# Altium project PCB_Project.PrjPcb
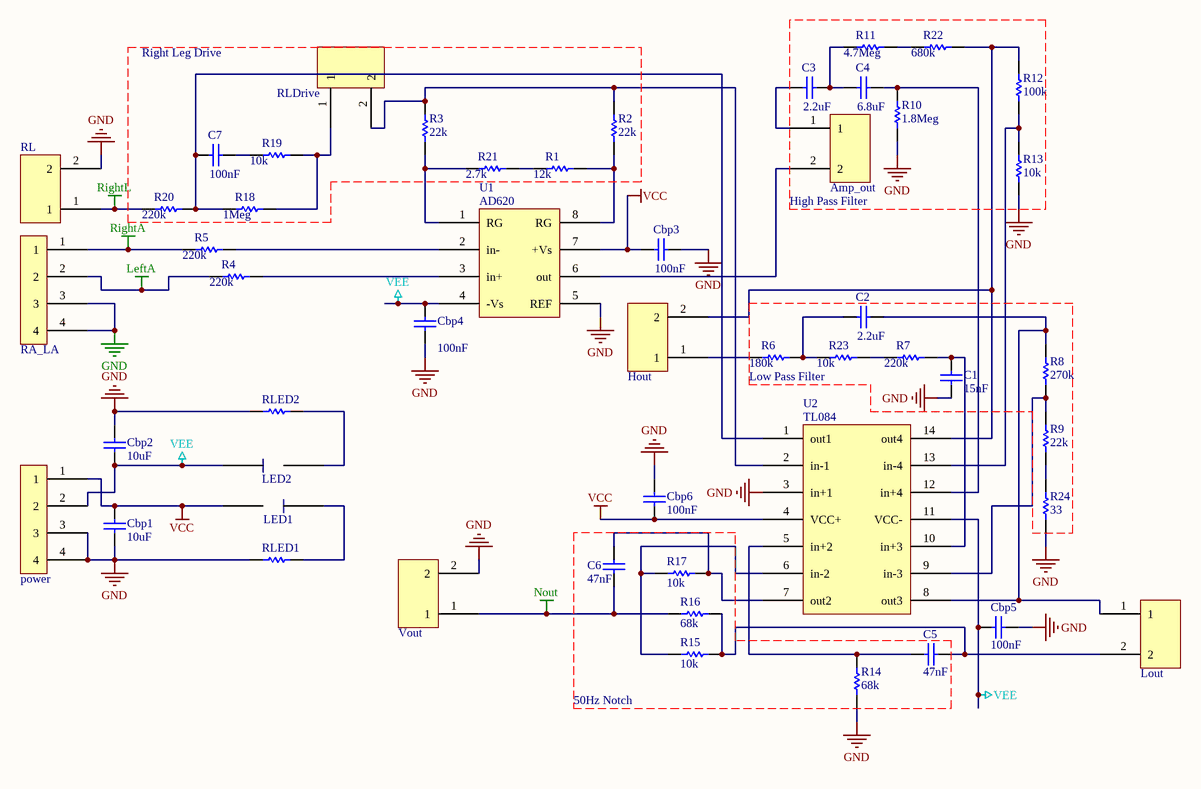
[diagram p0: Sheet2.~(3).SchDoc]
1 sheet, 51 parts. Net scope: global (net labels, ports and power ports of the same name join across sheets).
Board file: PCB5.PcbDoc

## Sheet Sheet2.~(3).SchDoc
size A4

### Parts
Amp_out  port  [pinheader]  (value not drawn)
C1  value 15nF  [cap]  (hidden comment: Cap)
C2  value 2.2uF  [cap]  (hidden comment: Cap)
C3  value 2.2uF  [cap]  (hidden comment: Cap)
C4  value 6.8uF  [cap]  (hidden comment: Cap)
C5  value 47nF  [cap]  (hidden comment: Cap)
C6  value 47nF  [cap]  (hidden comment: Cap)
C7  value 100nF  [cap]  (hidden comment: Cap)
Cbp1  value 10uF  [cap]  (hidden comment: Cap)
Cbp2  value 10uF  [cap]  (hidden comment: Cap)
Cbp3  value 100nF  [cap]  (hidden comment: Cap)
Cbp4  value 100nF  [cap]  (hidden comment: Cap)
Cbp5  value 100nF  [cap]  (hidden comment: Cap)
Cbp6  value 100nF  [cap]  (hidden comment: Cap)
Hout  port  [pinheader]  (value not drawn)
LED1  LED1  [LED1]  (value not drawn)
LED2  LED1  [LED1]  (value not drawn)
Lout  port  [pinheader]  (value not drawn)
power  pin4  [PINHEADER4]  (value not drawn)
R1  value 12k  [res]  (hidden comment: Res Semi)
R2  value 22k  [res]  (hidden comment: Res Semi)
R3  value 22k  [res]  (hidden comment: Res Semi)
R4  value 220k  [res]  (hidden comment: Res Semi)
R5  value 220k  [res]  (hidden comment: Res Semi)
R6  value 180k  [res]  (hidden comment: Res Semi)
R7  value 220k  [res]  (hidden comment: Res Semi)
R8  value 270k  [res]  (hidden comment: Res Semi)
R9  value 22k  [res]  (hidden comment: Res Semi)
R10  value 1.8Meg  [res]  (hidden comment: Res Semi)
R11  value 4.7Meg  [res]  (hidden comment: Res Semi)
R12  value 100k  [res]  (hidden comment: Res Semi)
R13  value 10k  [res]  (hidden comment: Res Semi)
R14  value 68k  [res]  (hidden comment: Res Semi)
R15  value 10k  [res]  (hidden comment: Res Semi)
R16  value 68k  [res]  (hidden comment: Res Semi)
R17  value 10k  [res]  (hidden comment: Res Semi)
R18  value 1Meg  [res]  (hidden comment: Res Semi)
R19  value 10k  [res]  (hidden comment: Res Semi)
R20  value 220k  [res]  (hidden comment: Res Semi)
R21  value 2.7k  [res]  (hidden comment: Res Semi)
R22  value 680k  [res]  (hidden comment: Res Semi)
R23  value 10k  [res]  (hidden comment: Res Semi)
R24  value 33  [res]  (hidden comment: Res Semi)
RA_LA  pin4  [PINHEADER4]  (value not drawn)
RL  port  [pinheader]  (value not drawn)
RLDrive  port  [pinheader]  (value not drawn)
RLED1  Res Semi  [res]  (value not drawn)
RLED2  Res Semi  [res]  (value not drawn)
U1  AD620  [AD620]
U2  TL084  [TL084]
Vout  port  [pinheader]  (value not drawn)

### Nets
GND: C1.1 Cbp1.1 Cbp2.2 Cbp3.2 Cbp4.1 Cbp5.1 Cbp6.1 power.3 power.4 R10.1 R13.1 R14.1 R24.1 RA_LA.3 RA_LA.4 RL.2 RLED1.1 RLED2.1 U1.5(REF) U2.3(in+1) Vout.2
LeftA: R4.1 RA_LA.2
Nout: C6.1 R16.1 Vout.1
RightA: R5.1 RA_LA.1
RightL: R20.1 RL.1
VCC: Cbp1.2 Cbp3.1 Cbp6.2 LED1.2(Anode) power.1 U1.7(+Vs) U2.4(VCC+)
VEE: Cbp2.1 Cbp4.2 Cbp5.2 LED2.1(kathod) power.2 U1.4(-Vs) U2.11(VCC-)
NetAmp_out_1: Amp_out.1 C3.1
NetAmp_out_2: Amp_out.2 U1.6(out)
NetC1_2: C1.2 R7.2 U2.10(in+3)
NetC2_1: C2.1 R6.2 R23.1
NetC2_2: C2.2 Lout.1 R8.2 U2.8(out3)
NetC3_2: C3.2 C4.1 R11.1
NetC4_2: C4.2 R10.2 U2.12(in+4)
NetC5_1: C5.1 Lout.2 R15.2 R16.2
NetC5_2: C5.2 R14.2 U2.5(in+2)
NetC6_2: C6.2 R17.2 U2.7(out2)
NetC7_1: C7.1 R18.1 R20.2 U2.1(out1)
NetC7_2: C7.2 R19.1
NetHout_1: Hout.1 R6.1
NetHout_2: Hout.2 R12.2 R22.2 U2.14(out4)
NetLED1_1: LED1.1(kathod) RLED1.2
NetLED2_2: LED2.2(Anode) RLED2.2
NetR1_1: R1.1 R21.2
NetR1_2: R1.2 R2.1 U1.8(RG)
NetR2_2: R2.2 R3.1 RLDrive.2 U2.2(in-1)
NetR3_2: R3.2 R21.1 U1.1(RG)
NetR4_2: R4.2 U1.3(in+)
NetR5_2: R5.2 U1.2(in-)
NetR7_1: R7.1 R23.2
NetR8_1: R8.1 R9.2 U2.9(in-3)
NetR9_1: R9.1 R24.2
NetR11_2: R11.2 R22.1
NetR12_1: R12.1 R13.2 U2.13(in-4)
NetR15_1: R15.1 R17.1 U2.6(in-2)
NetR18_2: R18.2 R19.2 RLDrive.1

### Notes on the sheet
- Right Leg Drive
- (near Amp_out) High Pass Filter
- Low Pass Filter
- 50Hz Notch

### Library data of the parts
C1-C7 Cbp1-Cbp6 = Cap: Capacitor; Published: 8-Jun-2000; LatestRevisionDate: 17-Jul-2002; LatestRevisionNote: Re-released for DXP Platform.; PackageReference: RAD-0.3; Publisher: Altium Limited; PackageDescription: Radial Cap, Thru-Hole; 2 Leads; 0.3 in Pin Spacing
R1-R24 RLED1 RLED2 = Res Semi: Semiconductor Resistor; Published: 8-Jun-2000; LatestRevisionDate: 17-Jul-2002; LatestRevisionNote: Re-released for DXP Platform.; PackageReference: AXIAL-0.5; Publisher: Altium Limited; PackageDescription: Axial Device, Thru-Hole; 2 Leads; 0.5 in Pin Spacing